# EAGLE design Gvove-Piezo Vibration Sensor (EAGLE 6.3)
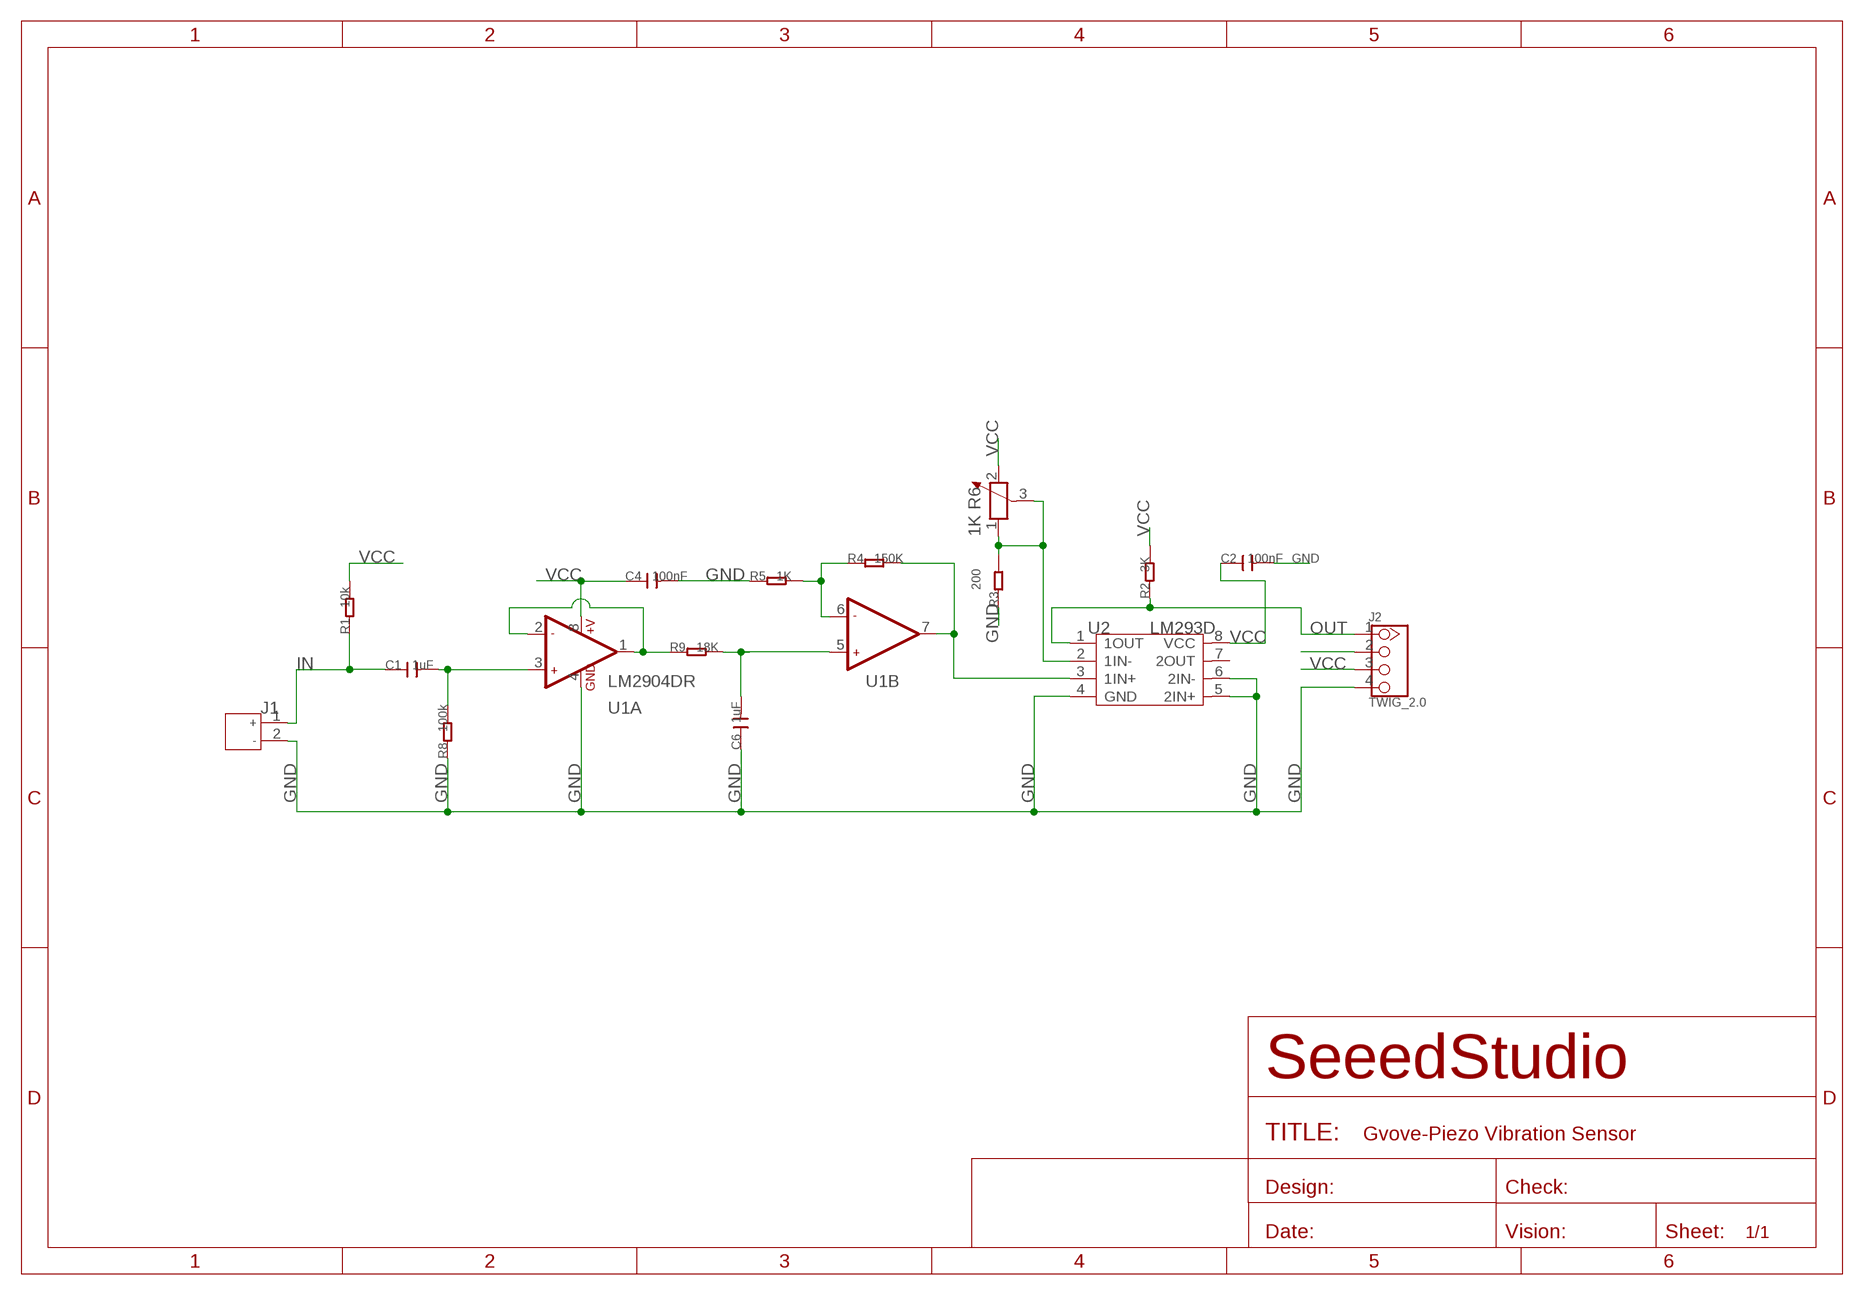
[diagram p0: schematic, sheet 1]

## Parts
C1  1uF  C-0603  [C0603]
C2  100nF  C-0603  [C0603]
C4  100nF  C-0603  [C0603]
C6  1uF  C-0603  [C0603]
J1  JACK-JST-2P-PW'2.0'  [JST-2.0]
J2  TWIG_2.0  [2.0_1X4]
R1  10k  R-0603  [R0603]
R2  3K  R-0603  [R0603]
R3  200  R-0603  [R0603]
R4  150K  R-0603  [R0603]
R5  1K  R-0603  [R0603]
R6  1K  R-POTENTIOMETER'3362'  [3P-SQUA-7X6.8]
R8  100k  R-0603  [R0603]
R9  18K  R-0603  [R0603]
U1  LM2904DR  LMV358D  [SO08]
U2  LM293D  [SOIC8-6.0]

## Nets
GND: C2.2 C4.2 C6.1 J1.2 J2.4 R3.1 R5.1 R8.1 U1.4(A:GND) U2.4(GND) U2.5(2IN+) U2.6(2IN-)
IN: C1.1 J1.1 R1.1
N$1: R3.2 R6.1 R6.3 U2.2(1IN-)
N$2: C1.2 R8.2 U1.3(A:+IN1)
N$3: R9.1 U1.1(A:OUT1) U1.2(A:-IN1)
N$4: R4.1 R5.2 U1.6(B:-IN2)
N$5: R4.2 U1.7(B:OUT2) U2.3(1IN+)
N$6: J2.2
N$9: C6.2 R9.2 U1.5(B:+IN2)
OUT: J2.1 R2.1 U2.1(1OUT)
VCC: C2.1 C4.1 J2.3 R1.2 R2.2 R6.2 U1.8(A:+V) U2.8(VCC)
Unconnected: U2.7(2OUT)

## Library data of the parts
C1 C2 C4 C6 = Discrete:C*: Ceramic Capacitors
J1 = Connector:JACK-JST-2P-PW
J2 = CONNECTER:TWIG_2.0
R1-R5 R8 R9 = Discrete:R*
R6 = Discrete:R-POTENTIOMETER*: Potentiometer
U1 = IC:LMV358: General purpose LOW Voltage, Rail-to-Rail Output Amplifiers http://www.fairchildsemi.com/ds/LM/LMV358.pdf
U2 = template:LM293: Dual Differential Comparator

## Board
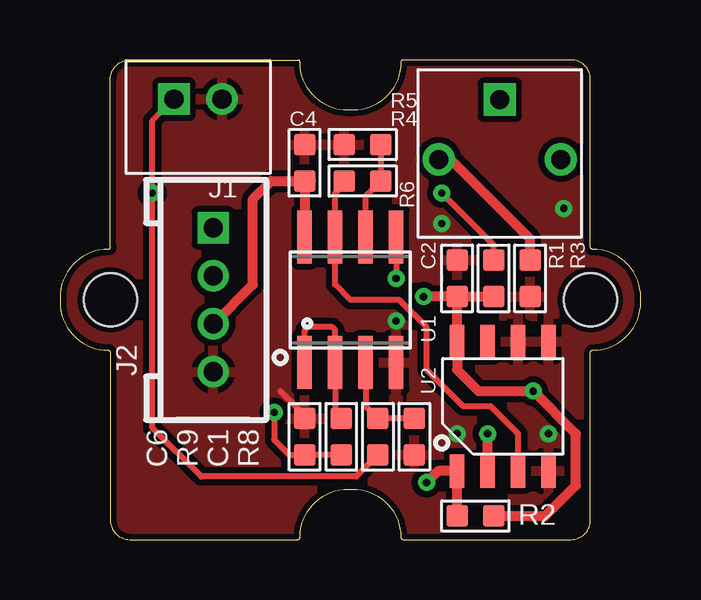
[diagram p1: board, top side]
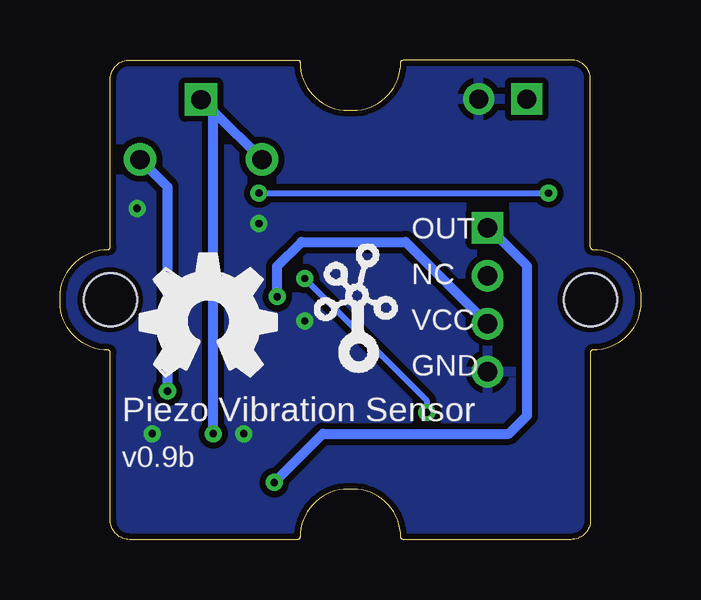
[diagram p2: board, bottom side, seen from below]

Size 24.2 x 20 mm. Coordinates in mm from the lower left corner, seen from the top.
Copper layers (1*16): Top 0.035mm / dielectric 1.5mm / Bottom 0.035mm
Design rules "default": minimum track width 10mil, minimum drill 10mil, track to track 8mil, track to pad 8mil, pad to pad 8mil, via to via 8mil, smd to smd 0mil, copper to edge 10mil, drill to drill 8mil, minimum pad ring 10mil, minimum via ring 8mil, stop-mask expansion 4mil, vias tented up to drill 25mil, thermal gap 10mil

### Footprints (pad centres in the part's own frame; a part is rotated, then mirrored left to right if it is on the bottom)
C0603 = smd 0.889 x 0.889: 1 -0.762,0; 2 0.762,0
JST-2.0 = drill 0.8 pad 1.3 square: 1 -1,0.75 | drill 0.8 pad 1.3: 2 1,0.75
2.0_1X4 = drill 0.8 pad 1.27 square: 1 -3,0 | drill 0.8 pad 1.27: 2 -1,0; 3 1,0; 4 3,0
R0603 = smd 0.889 x 0.889: 1 -0.762,0; 2 0.762,0
3P-SQUA-7X6.8 = drill 0.8 pad 1.35: 1 -2.54,-0.25; 2 2.54,-0.25 | drill 0.8 pad 1.35 square: 3 0,2.25
SO08 = smd 0.61 x 2.21: 1 -1.905,-2.616; 2 -0.635,-2.616; 3 0.635,-2.616; 4 1.905,-2.616; 5 1.905,2.616; 6 0.635,2.616; 7 -0.635,2.616; 8 -1.905,2.616
SOIC8-6.0 = smd 0.6 x 1.4: 1 -1.905,-2.7; 2 -0.635,-2.7; 3 0.635,-2.7; 4 1.905,-2.7; 5 1.905,2.7; 6 0.635,2.7; 7 -0.635,2.7; 8 -1.905,2.7
1U-DIM-W/-DRILL = hole 2.2: 0,-10; 0,10

### Placement (x,y rotation side)
C1  13.24,4.29 90 top
C2  16.55,10.89 90 top
C4  10.2,15.71 90 top
C6  10.2,4.29 270 top
J1  5.75,17.62 0 top
J2  6.38,10 270 top
R1  18.07,10.89 270 top
R2  17.31,0.98 0 top
R3  19.59,10.89 90 top
R4  12.61,14.95 180 top
R5  12.61,16.48 0 top
R6  18.32,16.1 0 top
R8  14.77,4.29 90 top
R9  11.72,4.29 270 top
U1  12.1,10 0 top
U2  18.45,5.55 0 top
U$1  [1U-DIM-W/-DRILL]  12.1,10 90 top
U$3  [TWIGLOGO_SMALL]  14,6.83 0 bottom
U$4  [OSHW_FILLX200_NOTEXT]  20.86,6.83 0 bottom

### Tracks (layer width: path | path; a pad name or v marks a point on that pad's centre or on a via)
GND  (via drill 0.3 pad 0.64)
  Top 0.254: U1.4 14,6.7 | C6.1 10.2,5.17 9.18,6.19
  other vias: 20.36,4.41 14,9.11 15.91,13.18 20.99,13.81 16.55,4.41
  pour Bottom (isolate 0.254): 0.04,-0.16 24.16,-0.16 24.16,20.16 0.04,20.16
  pour Top (isolate 0.254): 0.04,-0.16 24.16,-0.16 24.16,20.16 0.04,20.16
IN  (via drill 0.3 pad 0.64)
  Top 0.254: C1.1 12.35,2.63 5.88,2.63 3.84,4.67 v3.84,14.45 3.84,17.46 J1.1 | R1.1 18.07,12.29 v15.91,14.45
  Bottom 0.254: v15.91,14.45 v3.84,14.45
N$1  (via drill 0.3 pad 0.64)
  Top 0.406: R3.2 19.59,12.54 16.29,15.84 R6.1 | U2.2 v17.81,4.41
  Bottom 0.406: v17.81,4.41 17.81,17.87 | 17.81,17.87 18.32,18.38 R6.3 | 17.81,17.87 R6.1
N$2
  Top 0.254: R8.2 C1.2 12.73,5.55 U1.3
N$3
  Top 0.254: R9.1 11.46,5.3 U1.2 11.46,8.73 11.34,8.86 10.32,8.86 10.2,8.73 U1.1
N$4
  Top 0.254: U1.6 12.73,14.32 R4.1 R5.2
N$5
  Top 0.254: 11.85,14.83 11.46,14.45 U1.7 11.46,10.63 12.1,10 14.13,10 15.27,8.86 15.27,7.08 16.8,5.55 17.94,5.55 19.09,4.41 U2.3
  Top 0.406: R4.2 11.85,14.83
N$9  (via drill 0.3 pad 0.64)
  Top 0.254: R9.2 C6.2 9.56,3.52 8.93,4.16 v8.93,5.3 | U1.5 v14,10.89
  Bottom 0.254: v14,10.89 8.93,5.81 v8.93,5.3
OUT  (via drill 0.3 pad 0.64)
  Top 0.406: R2.1 U2.1 15.75,2.86 v15.27,2.38
  Bottom 0.406: J2.1 6.38,13.05 4.73,11.4 4.73,5.17 5.5,4.41 13.24,4.41 v15.27,2.38
VCC  (via drill 0.3 pad 0.64)
  Top 0.406: C4.1 U1.8 | C2.1 U2.8 16.55,7.08 17.43,6.19 v19.72,6.19 21.5,4.41 21.5,2.25 20.23,0.98 R2.2 | C2.1 R1.2 | J2.3 8.04,10.63 8.04,14.19 8.8,14.95 C4.1 | C2.1 v15.15,10.13 | 10.45,14.95 C4.1
  Bottom 0.406: v15.15,10.13 15.15,11.4 14.13,12.41 9.8,12.41 J2.3 | v19.72,6.19 19.72,14.7 R6.2

### Text on the board
bPlace: OUT | NC | VCC | GND | Piezo Vibration Sensor | v0.9b